# EAGLE schematic A.E.K (EAGLE 9.2.2)
Arduino Education Kit

## Sheet 1 of 2
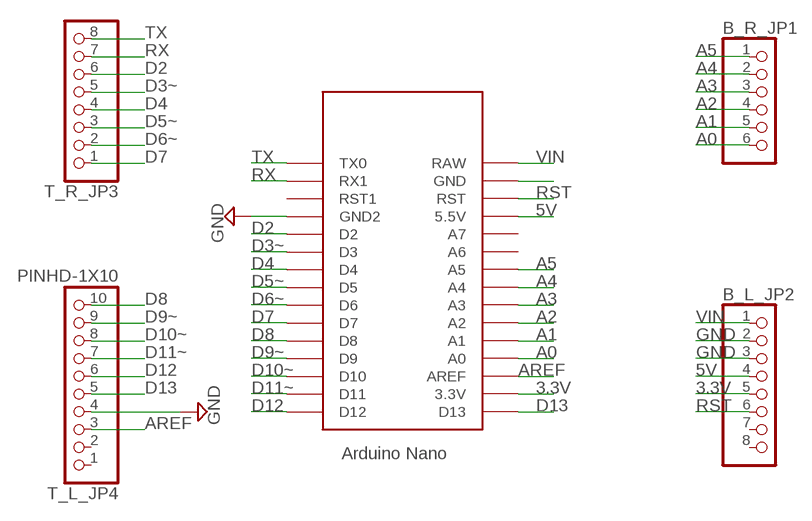
[diagram p0: schematic, sheet 1]

### Parts
B_L_JP2  PINHD-1X8BIG  [1X08-BIG]
B_R_JP1  PINHD-1X6B  [1X06-BIG]
T_L_JP4  PINHD-1X10  [1X10-BIG]
T_R_JP3  PINHD-1X8BIG  [1X08-BIG]
U$1  NANO  [NANO]

### Nets
3.3V: B_L_JP2.5 U$1.3.3V
5V: B_L_JP2.4 U$1.5V(5.5V) ; also sheet 2
A0: B_R_JP1.6 U$1.A0
A1: B_R_JP1.5 U$1.A1
A2: B_R_JP1.4 U$1.A2
A3: B_R_JP1.3 U$1.A3
A4: B_R_JP1.2 U$1.A4
A5: B_R_JP1.1 U$1.A5
AREF: T_L_JP4.3 U$1.AREF
D2: T_R_JP3.6 U$1.D2
D3~: T_R_JP3.5 U$1.D3
D4: T_R_JP3.4 U$1.D4
D5~: T_R_JP3.3 U$1.D5
D6~: T_R_JP3.2 U$1.D6
D7: T_R_JP3.1 U$1.D7
D8: T_L_JP4.10 U$1.D8
D9~: T_L_JP4.9 U$1.D9
D10~: T_L_JP4.8 U$1.D10
D11~: T_L_JP4.7 U$1.D11
D12: T_L_JP4.6 U$1.D12
D13: T_L_JP4.5 U$1.D13
GND: B_L_JP2.2 B_L_JP2.3 T_L_JP4.4 U$1.GND1(GND2)
N$37: U$1.GND
RST: B_L_JP2.6 U$1.RST
RX: T_R_JP3.7 U$1.RX1
TX: T_R_JP3.8 U$1.TX0
VIN: B_L_JP2.1 U$1.RAW
Unconnected: B_L_JP2.7 B_L_JP2.8 T_L_JP4.1 T_L_JP4.2 U$1.A6 U$1.A7 U$1.ICSP1 U$1.ICSP2 U$1.ICSP3 U$1.ICSP4 U$1.ICSP5 U$1.ICSP6 U$1.RST1

## Sheet 2 of 2: 2 LED: RGB 4 pin, Normal 2 Pin
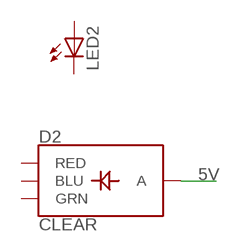
[diagram p1: schematic, sheet 2]

### Parts
D2  CLEAR  LED-RGB-CACLEAR  [LED-RGB-THRU]
LED2  LED5MM  [LED5MM]

### Nets
5V: D2.2(A) ; also sheet 1
Unconnected: D2.1(RED) D2.3(GRN) D2.4(BLU) LED2.A LED2.K(C)

## Library data of the parts
B_L_JP2 T_R_JP3 = adafruit:PINHD-1X8: PIN HEADER
B_R_JP1 = adafruit:PINHD-1X6: PIN HEADER
D2 = SparkFun-LED:LED-RGB-CA: LED-RGB Diffused Common Anode Packages: LED RGB-THRU P-LCC-4-3 LED-TRICOLOR-SMD SparkFun Products: RGB Diffused Common Anode- Diffuse <[https://www.sparkfun.com/products/10821]> RGB Diffused Common Anode - Clear <[https://www.sparkfun.com/products/10820]> Qduino Mini <[https://www.sparkfun.com/products/13614]> Triple Output LED RGB - SMD <https://www.sparkfun.com/products/7844>; PROD_ID: DIO-10631
LED2 = adafruit:LED: LED OSRAM: - CHIPLED LG R971, LG N971, LY N971, LG Q971, LY Q971, LO R971, LY R971 LH N974, LH R974 LS Q976, LO Q976, LY Q976 LO Q996 - Hyper CHIPLED LW Q18S LB Q993, LB Q99A, LB R99A - SideLED LS A670, LO A670, LY A670, LG A670, LP A670 LB A673, LV A673, LT A673, LW A673 LH A674 LY A675 LS A676, LA A676, LO A676, LY A676, LW A676 LS A679, LY A679, LG A679 - Hyper Micro SIDELED® LS Y876, LA Y876, LO Y876, LY Y876 LT Y87S - SmartLED LW L88C, LW L88S LB L89C, LB L89S, LG L890 LS L89K, LO L89K, LY L89K LS L896, LA L896, LO L896, LY L896 - TOPLED LS T670, LO T670, LY T670, LG T670, LP T670 LSG T670, LSP T670, LSY T670, LOP T670, LYG T670 LG T671, LOG T671, LSG T671 LB T673, LV T673, LT T673, LW T673 LH T674 LS T676, LA T676, LO T676, LY T676, LB T676, LH T676, LSB T676, LW T676 LB T67C, LV T67C, LT T67C, LS T67K, LO T67K, LY T67K, LW E67C LS E67B, LA E67B, LO E67B, LY E67B, LB E67C, LV E67C, LT E67C LW T67C LS T679, LY T679, LG T679 LS T770, LO T770, LY T770, LG T770, LP T770 LB T773, LV T773, LT T773, LW T773 LH T774 LS E675, LA E675, LY E675, LS T675 LS T776, LA T776, LO T776, LY T776, LB T776 LHGB T686 LT T68C, LB T68C - Hyper Mini TOPLED® LB M676 - Mini TOPLED Santana® LG M470 LS M47K, LO M47K, LY M47K Source: http://www.osram.convergy.de/
T_L_JP4 = adafruit:PINHD-1X10: Pin header 1x10 0.1" spacing With round pins
U$1 = Arduino-clone:NANO: Arduino Nano